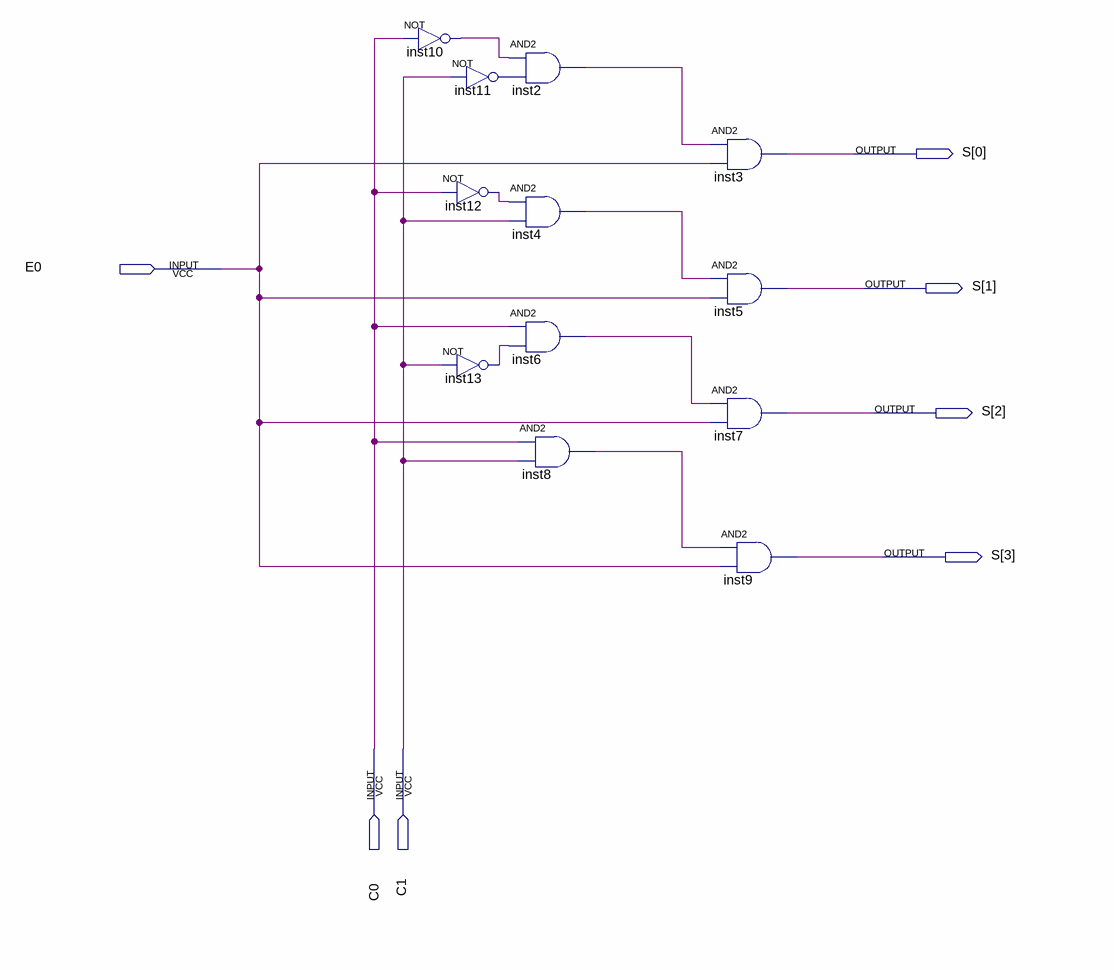
[diagram p0: schematic sheet]
// Quartus schematic demux.bdf as structural Verilog: 12 symbols, 7 pins
module demux (
  input  E0,
  input  C0,
  input  C1,
  output [3:0] S
);

  wire inst2_out, inst4_out, inst6_out, inst8_out, inst10_out, inst11_out, inst12_out, inst13_out;

  not inst10 (inst10_out, C0);
  not inst11 (inst11_out, C1);
  not inst12 (inst12_out, C0);
  not inst13 (inst13_out, C1);
  and inst2 (inst2_out, inst10_out, inst11_out);
  and inst4 (inst4_out, inst12_out, C1);
  and inst6 (inst6_out, C0, inst13_out);
  and inst8 (inst8_out, C0, C1);
  and inst3 (S[0], inst2_out, E0);
  and inst5 (S[1], inst4_out, E0);
  and inst7 (S[2], inst6_out, E0);
  and inst9 (S[3], inst8_out, E0);
endmodule
